# Altium schematic sheet control-pedal.SchDoc: Control Pedal Interface
size A4; Organization: heig-vd; Address1: heig-vd; Address2: Route de Cheseaux 1; Address3: 1401 Yverdon-les-Bains; Address4: Suisse; DocumentNumber: 8; Revision: 1.1; SheetNumber: 8; SheetTotal: 12
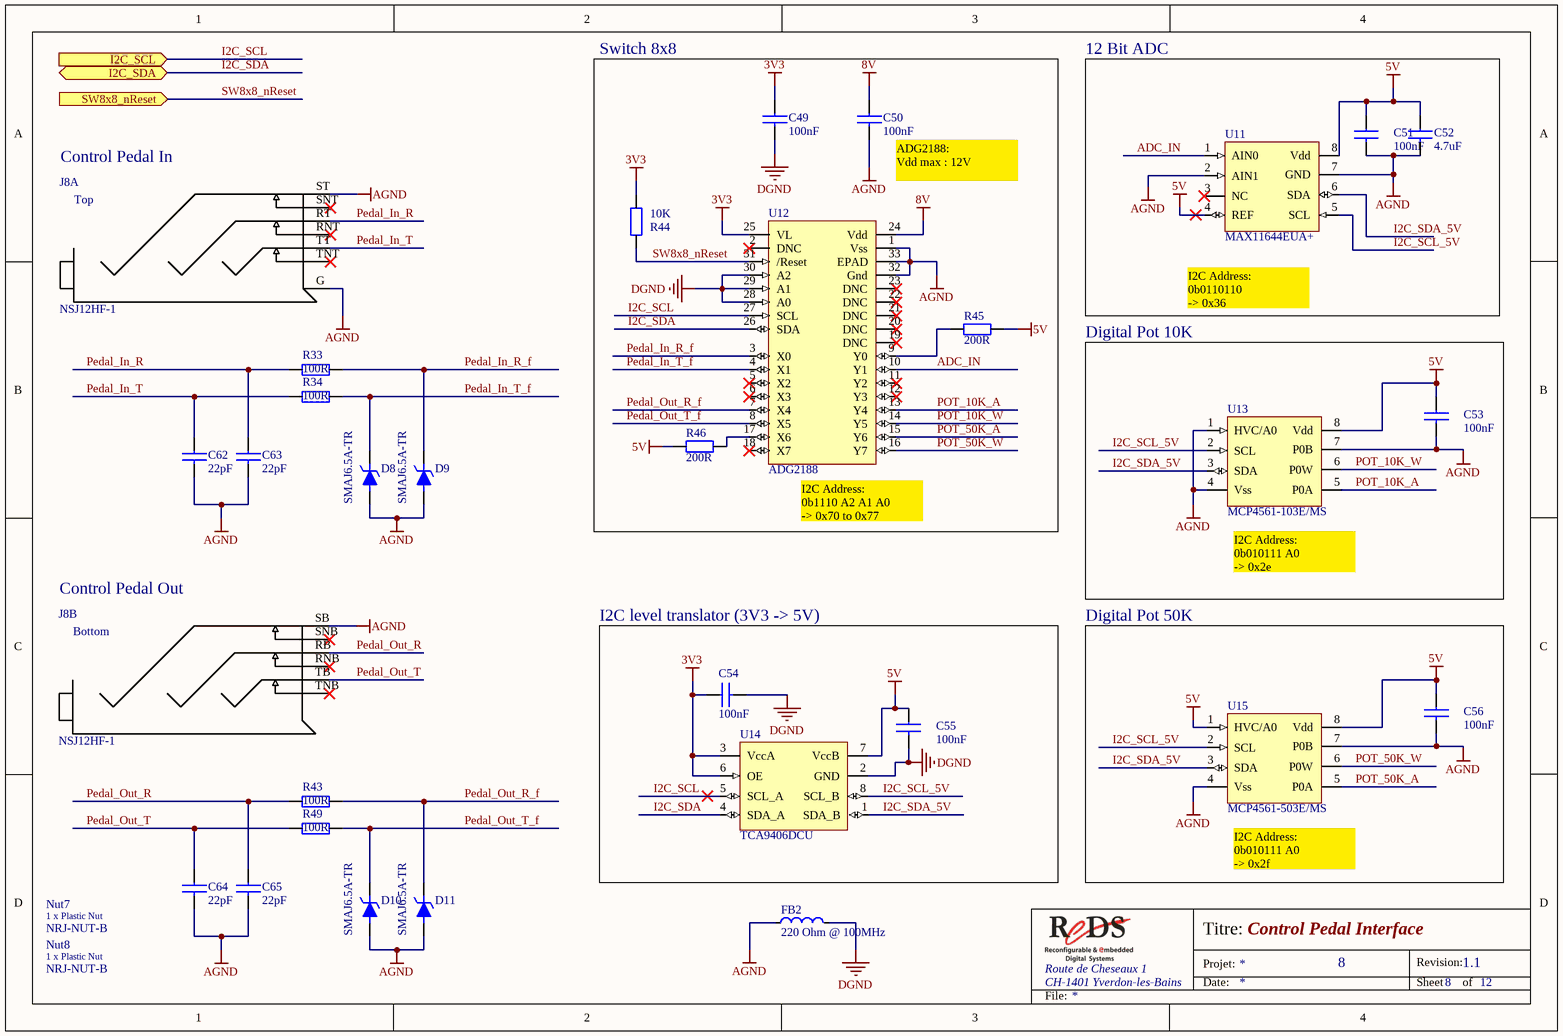
[diagram p0: control-pedal.SchDoc]

## Parts
C49  100nF  [SM/C_0603]
C50  100nF  [SM/C_0603]
C51  100nF  [SM/C_0603]
C52  4.7uF  [SM/C_0805]
C53  100nF  [SM/C_0603]
C54  100nF  [SM/C_0603]
C55  100nF  [SM/C_0603]
C56  100nF  [SM/C_0603]
C62  22pF  [SM/C_0603]
C63  22pF  [SM/C_0603]
C64  22pF  [SM/C_0603]
C65  22pF  [SM/C_0603]
D8  SMAJ6.5A-TR  [SM/D_DO214-AC (SMA)]
D9  SMAJ6.5A-TR  [SM/D_DO214-AC (SMA)]
D10  SMAJ6.5A-TR  [SM/D_DO214-AC (SMA)]
D11  SMAJ6.5A-TR  [SM/D_DO214-AC (SMA)]
FB2  value 220 Ohm @ 100MHz  [SM/L_0805]  (hidden comment: LM21PG221SN1D)
J8  NSJ12HF-1  [NSJ12HF-1]  (parts A,B of 2)
Nut7  NRJ-NUT-B  (mechanical)
Nut8  NRJ-NUT-B  (mechanical)
R33  100R  [SM/R_0603]
R34  100R  [SM/R_0603]
R43  100R  [SM/R_0603]
R44  10K  [SM/R_0603]
R45  200R  [SM/R_0603]
R46  200R  [SM/R_0603]
R49  100R  [SM/R_0603]
U11  MAX11644EUA+  [uMAX-8]
U12  ADG2188  [VFQFN-32_(32-Lead LFCSP_VQ)]
U13  MCP4561-103E/MS  [MSOP-8]
U14  TCA9406DCU  [VSSOP-8]
U15  MCP4561-503E/MS  [MSOP-8]

## Blocks framed on the sheet
Switch 8x8: C49 C50 R44-R46 U12
12 Bit ADC: C51 C52 U11
Digital Pot 10K: C53 U13
I2C level translator (3V3 -> 5V): C54 C55 U14
Digital Pot 50K: C56 U15

## Ports
I2C_SCL (in), I2C_SDA (bidir), SW8x8_nReset (in)

## Nets
3V3: C49.1 C54.1 R44.1 U12.25(VL) U14.3(VccA) U14.6(OE)
5V: C51.1 C52.1 C53.1 C55.1 C56.1 R45.2 R46.1 U11.4(REF) U11.8(Vdd) U13.8(Vdd) U14.7(VccB) U15.1(HVC/A0) U15.8(Vdd)
8V: C50.1 U12.24(Vdd)
AGND: C50.2 C51.2 C52.2 C53.2 C56.2 C62.2 C63.2 C64.2 C65.2 D8.1(A) D9.1(A) D10.1(A) D11.1(A) FB2.1 J8.G J8.SB J8.ST U11.2(AIN1) U11.7(GND) U12.1(Vss) U12.32(Gnd) U12.33(EPAD) U13.1(HVC/A0) U13.4(Vss) U13.7(P0B) U15.4(Vss) U15.7(P0B)
DGND: C49.2 C54.2 C55.2 FB2.2 U12.28(A0) U12.29(A1) U12.30(A2) U14.2(GND)
ADC_IN: U11.1(AIN0) U12.10(Y1)
I2C_SCL: U12.27(SCL) U14.5(SCL_A) ; port I2C_SCL
I2C_SCL_5V: U11.5(SCL) U13.2(SCL) U14.8(SCL_B) U15.2(SCL)
I2C_SDA: U12.26(SDA) U14.4(SDA_A) ; port I2C_SDA
I2C_SDA_5V: U11.6(SDA) U13.3(SDA) U14.1(SDA_B) U15.3(SDA)
Pedal_In_R: C63.1 J8.RT R33.1
Pedal_In_R_f: D9.2(C) R33.2 U12.3(X0)
Pedal_In_T: C62.1 J8.TT R34.1
Pedal_In_T_f: D8.2(C) R34.2 U12.4(X1)
Pedal_Out_R: C65.1 J8.RB R43.1
Pedal_Out_R_f: D11.2(C) R43.2 U12.7(X4)
Pedal_Out_T: C64.1 J8.TB R49.1
Pedal_Out_T_f: D10.2(C) R49.2 U12.8(X5)
POT_10K_A: U12.13(Y4) U13.5(P0A)
POT_10K_W: U12.14(Y5) U13.6(P0W)
POT_50K_A: U12.15(Y6) U15.5(P0A)
POT_50K_W: U12.16(Y7) U15.6(P0W)
SW8x8_nReset: R44.2 U12.31(/Reset) ; port SW8x8_nReset
NetR45_1: R45.1 U12.9(Y0)
NetR46_2: R46.2 U12.17(X6)

Not connected (* = marked no-connect by the designer): J8 RNB* RNT* SNB* SNT* TNB* TNT*; U11 3(NC)*; U12 2(DNC)* 5(X2)* 6(X3)* 11(Y2)* 12(Y3)* 18(X7)* 19(DNC)* 20(DNC)* 21(DNC)* 22(DNC)* 23(DNC)*

## Notes on the sheet
- Control Pedal In
- (near C50) ADG2188:
  Vdd max : 12V
- (near U11) I2C Address:
  0b0110110
  -> 0x36
- (near U12) I2C Address:
  0b1110 A2 A1 A0
  -> 0x70 to 0x77
- (near U13) I2C Address:
  0b010111 A0
  -> 0x2e
- Control Pedal Out
- (near U15) I2C Address:
  0b010111 A0
  -> 0x2f
- Route de Cheseaux 1
- CH-1401 Yverdon-les-Bains
- Titre:
- Date:
- Projet:
- Revision:
- Sheet
- of
- File:
- (in symbol Jack 6.35 NSJ12HF-1, part A) Top
- (in symbol Jack 6.35 NSJ12HF-1, part B) Bottom
- (in symbol Jack 6.35 Plastic Nut) 1 x Plastic Nut

## Library data of the parts
C49-C51 C53-C56 = 182: Ceramic multi-layer; Manufacturer: AVX; Manufacturer P/N: 0603YC104KAZ2A; ID: 182; Voltage: 16V; Tolerance: ±10%; Value: 100nF; Component Type: Capacitor, non-polarized; Supplier 1: Farnell; Supplier Part Number 1: 7569556; RoHS Compliant: True
C52 = 405: Ceramic multi-layer; Manufacturer: muRata; Manufacturer P/N: GRM219R60J475KE19D; ID: 405; Voltage: 6.3V; Tolerance: ±10%; Value: 4.7uF; Component Type: Capacitor, non-polarized; Supplier 1: Farnell; Supplier Part Number 1: 9522999; RoHS Compliant: True
C62-C65 = 216: Capacitor, ceramic; Manufacturer: Kemet; Manufacturer P/N: C0603C220J5GAC; ID: 216; Voltage: 50V; Tolerance: ±5%; Value: 22pF; Component Type: Capacitor, non-polarized; Supplier 1: Farnell; Supplier Part Number 1: 1414622; RoHS Compliant: True
D8-D11 = 558: Transil™ diode; Manufacturer: STMicroelectronics; ID: 558; Component Type: Diode TVS; Manufacturer P/N: SMAJ6.5A-TR; Value: SMAJ6.5A-TR; Supplier 1: Farnell; Supplier Part Number 1: 1749312; RoHS Compliant: False
FB2 = 1991: PERLE DE FERRITE 0805. 220 OHMS/100MHz; Manufacturer: Murata; ID: 1991; Tolerance: ± 25%; Component Type: Ferrite; Manufacturer P/N: LM21PG221SN1D; Supplier 1: Digi-Key; Supplier Part Number 1: 490-1054-1-ND; RoHS Compliant: True
J8 = Jack 6.35 NSJ12HF-1: Neutronik 2xJack 6.35 connector; Supplier 1: Allied; Supplier 2: Newark; Supplier 3: Mouser; Supplier Part Number 1: 70549361; Supplier Part Number 2: 10J0817; Supplier Part Number 3: 568-NSJ12HF-1
Nut7 Nut8 = Jack 6.35 Plastic Nut: Plastic Nut to fasten 6.35 jack; Manufacturer: Neutrik; Manufacturer P/N: NRJ-NUT-B; Supplier 1: Mouser; Supplier 2: Allied; Supplier Part Number 1: 550-1005; Supplier Part Number 2: 70088339
R33 R34 R43 R49 = 85: Résistance 0603 63mW 1% 100R; Manufacturer: Multicomp; Manufacturer P/N: MC 0.036mW 0603 1% 100R; ID: 85; Voltage: 50V; Value: 100R; Component Type: Résistance; Power: 63mW; Tolerance: 1%; Supplier 1: Farnell; Supplier Part Number 1: 9330364; RoHS Compliant: False
R44 = 133: Résistance 0603 63mW 1% 10K; Manufacturer: Multicomp; Manufacturer P/N: MC 0.036mW 0603 1% 10K; ID: 133; Voltage: 50V; Value: 10K; Component Type: Résistance; Power: 63mW; Tolerance: 1%; Supplier 1: Farnell; Supplier Part Number 1: 9330399; RoHS Compliant: False
R45 R46 = 92: Résistance 0603 63mW 1% 200R; Manufacturer: Multicomp; Manufacturer P/N: MC 0.036mW 0603 1% 200R; ID: 92; Voltage: 50V; Value: 200R; Component Type: Résistance; Power: 63mW; Tolerance: 1%; Supplier 1: Farnell; Supplier Part Number 1: 9330755; RoHS Compliant: False
U11 = MAX11644: ADC 12Bit I2C; Supplier 1: Digi-Key; Supplier Part Number 1: MAX11644EUA+-ND
U12 = ADG2188: Switch 8x8
U13 = MCP4561-103E/MS: I2C Digital pot 10K; Supplier 1: Digi-Key; Supplier 2: Arrow; Supplier Part Number 1: MCP4561-103E/MS-ND; Supplier Part Number 2: lpxp5-gz8NvOdK2CvBd4ZmtK0HMy7y-wCK48FmQm7X4
U14 = TCA9406: I2C Voltage level translator; Supplier 1: Arrow; Supplier 2: Digi-Key; Supplier Part Number 1: PK32Fc7LI8q2iMXYHZWqHxYKLTLCH2B1ORNgaiWt9EM; Supplier Part Number 2: 296-28109-1-ND
U15 = MCP4561-503E/MS: I2C Digital pot 50K; Supplier 1: Digi-Key; Supplier 2: Arrow; Supplier Part Number 1: MCP4561-503E/MS-ND; Supplier Part Number 2: lpxp5-gz8NvOdK2CvBd4ZtM6b7sy6fNNyje9_7_wP3c